# Altium schematic sheet LWIR_FPGA_Misc.SchDoc
size A4
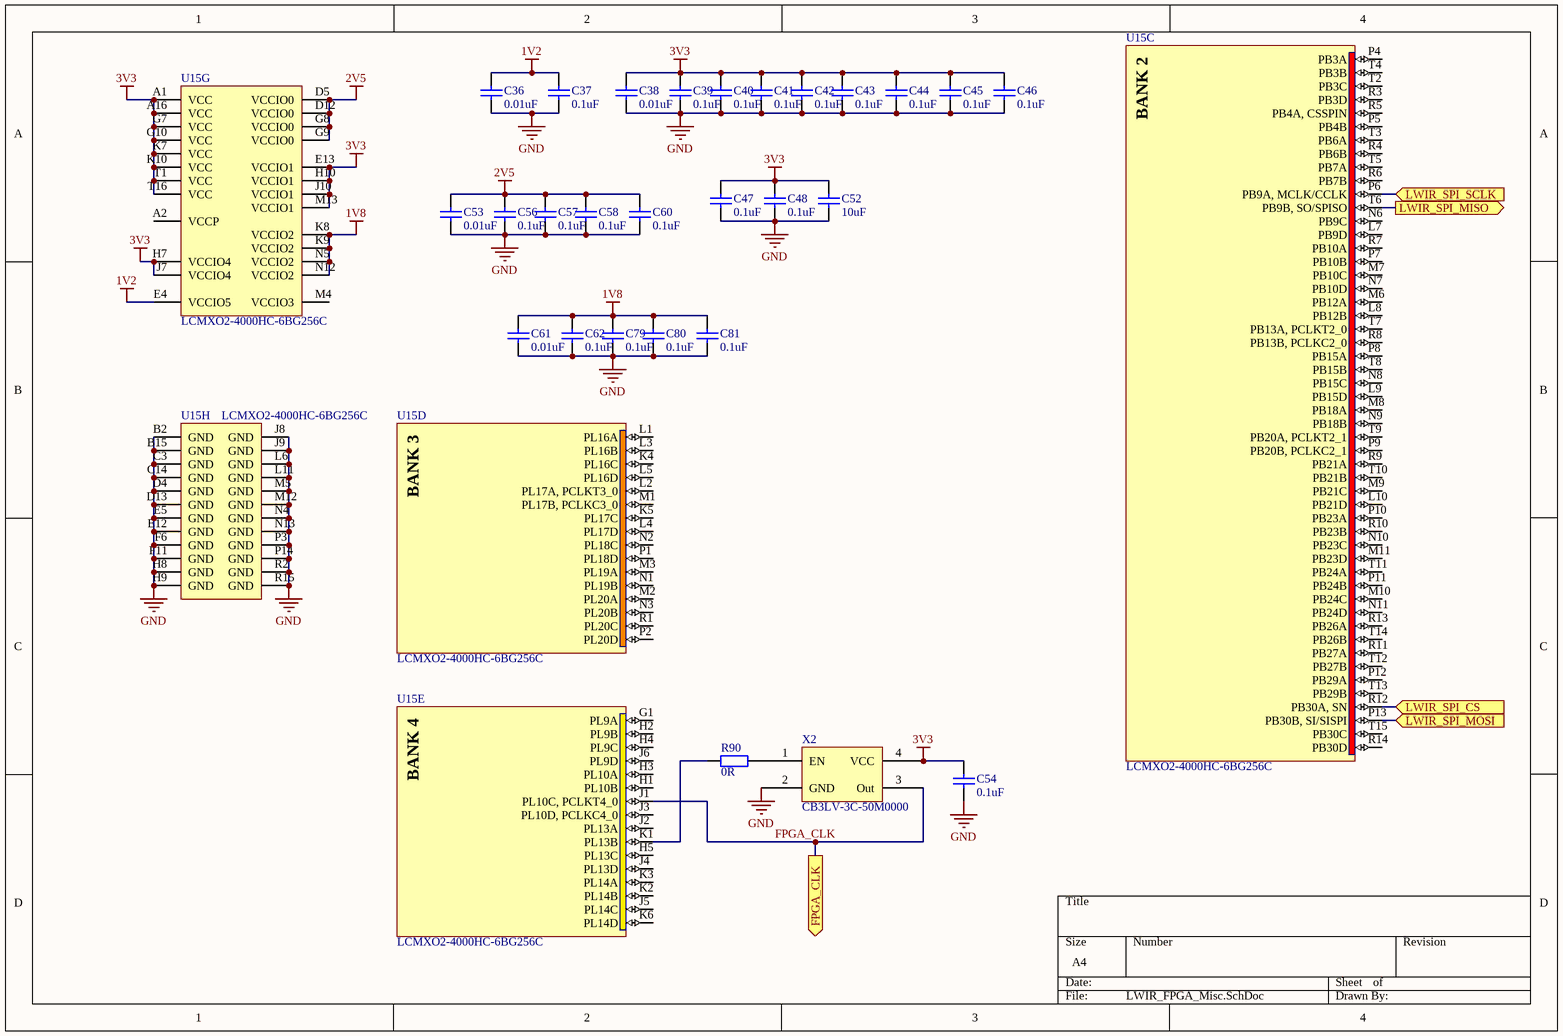
[diagram p0: LWIR_FPGA_Misc.SchDoc]

## Parts
C36  value 0.01uF  [0402C_M]  (hidden comment: GRM155R71H103KA88D)
C37  Capacitance: 0.1uF  [0402C_M]  (hidden comment: GRM155R71C104KA88D)
C38  value 0.01uF  [0402C_M]  (hidden comment: GRM155R71H103KA88D)
C39  Capacitance: 0.1uF  [0402C_M]  (hidden comment: GRM155R71C104KA88D)
C40  Capacitance: 0.1uF  [0402C_M]  (hidden comment: GRM155R71C104KA88D)
C41  Capacitance: 0.1uF  [0402C_M]  (hidden comment: GRM155R71C104KA88D)
C42  Capacitance: 0.1uF  [0402C_M]  (hidden comment: GRM155R71C104KA88D)
C43  Capacitance: 0.1uF  [0402C_M]  (hidden comment: GRM155R71C104KA88D)
C44  Capacitance: 0.1uF  [0402C_M]  (hidden comment: GRM155R71C104KA88D)
C45  Capacitance: 0.1uF  [0402C_M]  (hidden comment: GRM155R71C104KA88D)
C46  Capacitance: 0.1uF  [0402C_M]  (hidden comment: GRM155R71C104KA88D)
C47  Capacitance: 0.1uF  [0402C_M]  (hidden comment: GRM155R71C104KA88D)
C48  Capacitance: 0.1uF  [0402C_M]  (hidden comment: GRM155R71C104KA88D)
C52  value 10uF  [0603C_M]  (hidden comment: GRM188R60J106ME47D)
C53  value 0.01uF  [0402C_M]  (hidden comment: GRM155R71H103KA88D)
C54  Capacitance: 0.1uF  [0402C_M]  (hidden comment: GRM155R71C104KA88D)
C56  Capacitance: 0.1uF  [0402C_M]  (hidden comment: GRM155R71C104KA88D)
C57  Capacitance: 0.1uF  [0402C_M]  (hidden comment: GRM155R71C104KA88D)
C58  Capacitance: 0.1uF  [0402C_M]  (hidden comment: GRM155R71C104KA88D)
C60  Capacitance: 0.1uF  [0402C_M]  (hidden comment: GRM155R71C104KA88D)
C61  value 0.01uF  [0402C_M]  (hidden comment: GRM155R71H103KA88D)
C62  Capacitance: 0.1uF  [0402C_M]  (hidden comment: GRM155R71C104KA88D)
C79  Capacitance: 0.1uF  [0402C_M]  (hidden comment: GRM155R71C104KA88D)
C80  Capacitance: 0.1uF  [0402C_M]  (hidden comment: GRM155R71C104KA88D)
C81  Capacitance: 0.1uF  [0402C_M]  (hidden comment: GRM155R71C104KA88D)
R90  value 0R  [0402R_M]  (hidden comment: Generic resitor)
U15  LCMXO2-4000HC-6BG256C  [caBGA256]  (parts C,D,E,G,H of 8)
X2  CB3LV-3C-50M0000  [CB3LV-3C-50M0000]

## Ports
FPGA_CLK (out), LWIR_SPI_CS (in), LWIR_SPI_MISO (out), LWIR_SPI_MOSI (in), LWIR_SPI_SCLK (in)

## Nets
1V2: C36.2 C37.2 U15.E4(VCCIO5)
1V8: C61.2 C62.2 C79.2 C80.2 C81.2 U15.K8(VCCIO2) U15.K9(VCCIO2) U15.N5(VCCIO2) U15.N12(VCCIO2)
2V5: C53.2 C56.2 C57.2 C58.2 C60.2 U15.D5(VCCIO0) U15.D12(VCCIO0) U15.G8(VCCIO0) U15.G9(VCCIO0)
3V3: C38.2 C39.2 C40.2 C41.2 C42.2 C43.2 C44.2 C45.2 C46.2 C47.2 C48.2 C52.2 C54.2 U15.A1(VCC) U15.A16(VCC) U15.E13(VCCIO1) U15.G7(VCC) U15.G10(VCC) U15.H7(VCCIO4) U15.H10(VCCIO1) U15.J7(VCCIO4) U15.J10(VCCIO1) U15.K7(VCC) U15.K10(VCC) U15.M13(VCCIO1) U15.T1(VCC) U15.T16(VCC) X2.4(VCC)
GND: C36.1 C37.1 C38.1 C39.1 C40.1 C41.1 C42.1 C43.1 C44.1 C45.1 C46.1 C47.1 C48.1 C52.1 C53.1 C54.1 C56.1 C57.1 C58.1 C60.1 C61.1 C62.1 C79.1 C80.1 C81.1 U15.B2(GND) U15.B15(GND) U15.C3(GND) U15.C14(GND) U15.D4(GND) U15.D13(GND) U15.E5(GND) U15.E12(GND) U15.F6(GND) U15.F11(GND) U15.H8(GND) U15.H9(GND) U15.J8(GND) U15.J9(GND) U15.L6(GND) U15.L11(GND) U15.M5(GND) U15.M12(GND) U15.N4(GND) U15.N13(GND) U15.P3(GND) U15.P14(GND) U15.R2(GND) U15.R15(GND) X2.2(GND)
FPGA_CLK: U15.J1(PL10C,_PCLKT4_0) X2.3(Out) ; port FPGA_CLK
LWIR_SPI_CS: U15.R12(PB30A,_SN) ; port LWIR_SPI_CS
LWIR_SPI_MISO: U15.T6(PB9B,_SO/SPISO) ; port LWIR_SPI_MISO
LWIR_SPI_MOSI: U15.P13(PB30B,_SI/SISPI) ; port LWIR_SPI_MOSI
LWIR_SPI_SCLK: U15.P6(PB9A,_MCLK/CCLK) ; port LWIR_SPI_SCLK
NetR90_1: R90.1 U15.K1(PL13B)
NetR90_2: R90.2 X2.1(EN)

Not connected (* = marked no-connect by the designer): U15 A2(VCCP) G1(PL9A) H1(PL10B) H2(PL9B) H3(PL10A) H4(PL9C) H5(PL13C) J2(PL13A) J3(PL10D,_PCLKC4_0) J4(PL13D) J5(PL14C) J6(PL9D) K2(PL14B) K3(PL14A) K4(PL16C) K5(PL17C) K6(PL14D) L1(PL16A) L2(PL17A,_PCLKT3_0) L3(PL16B) L4(PL17D) L5(PL16D) L7(PB9D) L8(PB12B) L9(PB15D) L10(PB21D) M1(PL17B,_PCLKC3_0) M2(PL20A) M3(PL19A) M4(VCCIO3) M6(PB12A) M7(PB10C) M8(PB18A) M9(PB21C) M10(PB24C) M11(PB23D) N1(PL19B) N2(PL18C) N3(PL20B) N6(PB9C) N7(PB10D) N8(PB15C) N9(PB18B) N10(PB23C) N11(PB24D) P1(PL18D) P2(PL20D) P4(PB3A) P5(PB4B) P7(PB10B) P8(PB15A) P9(PB20B,_PCLKC2_1) P10(PB23A) P11(PB24B) P12(PB29A) R1(PL20C) R3(PB3D) R4(PB6B) R5(PB4A,_CSSPIN) R6(PB7B) R7(PB10A) R8(PB13B,_PCLKC2_0) R9(PB21A) R10(PB23B) R11(PB27A) R13(PB26A) R14(PB30D) T2(PB3C) T3(PB6A) T4(PB3B) T5(PB7A) T7(PB13A,_PCLKT2_0) T8(PB15B) T9(PB20A,_PCLKT2_1) T10(PB21B) T11(PB24A) T12(PB27B) T13(PB29B) T14(PB26B) T15(PB30C)

## Notes on the sheet
- (in symbol CMP-0111-00181-1, part C) BANK 2
- (in symbol CMP-0111-00181-1, part D) BANK 3
- (in symbol CMP-0111-00181-1, part E) BANK 4

## Library data of the parts
C36 C38 C53 C61 = GRM155R71H103KA88D: CAP CER 0.01uF 50V X7R 0402; Manufacturer: Murata Electronics North America; Tolerance: ±10%; Supplier 1: Digi-Key; Manufacturer Part Number: GRM155R71H103KA88D; RoHS: RoHS Compliant; Category: Capacitors; Stock 1: 10436079; Pricing 1: 1=0.1, 10=0.011, 100=0.005, 500=0.00354, 1000=0.00278, 2500=0.00253, 5000=0.00233 (USD); Packaging: Cut Tape (CT); Part Status: Active; Voltage - Rated: 50V; Temperature Coefficient: X7R; Operating Temperature: -55°C ~ 125°C; Features: -; Ratings: -; Applications: General Purpose; Mounting Type: Surface Mount, MLCC; Package / Case: 0402 (1005 Metric); Size / Dimension: 0.039" L x 0.020" W (1.00mm x 0.50mm); Height - Seated (Max): -; Thickness (Max): 0.022" (0.55mm); Lead Spacing: -; Lead Style: -; ComponentLink1URL: http://www.murata.com/~/media/webrenewal/support/library/catalog/products/capacitor/mlcc/c02e.pdf; ComponentLink1Description: http://www.murata.com/~/media/webrenewal/support/library/catalog/products/capacitor/mlcc/c02e.pdf; Supplier Part Number 1: 490-4516-1-ND
C37 C39-C48 C54 C56-C58 C60 C62 C79-C81 = GRM155R71C104KA88D: CAP CER 0.1UF 16V X7R 0402; Manufacturer: Murata Electronics North America; Tolerance: ±10%; Supplier 1: Digi-Key; Manufacturer Part Number: GRM155R71C104KA88D; RoHS: RoHS Compliant; Category: Capacitors; Stock 1: 58190082; Pricing 1: 1=0.1, 10=0.013, 100=0.0059, 500=0.00422, 1000=0.00332, 2500=0.00302, 5000=0.00278 (USD); Packaging: Cut Tape (CT); Part Status: Active; Voltage - Rated: 16V; Temperature Coefficient: X7R; Operating Temperature: -55°C ~ 125°C; Features: -; Ratings: -; Applications: General Purpose; Mounting Type: Surface Mount, MLCC; Package / Case: 0402 (1005 Metric); Size / Dimension: 0.039" L x 0.020" W (1.00mm x 0.50mm); Height - Seated (Max): -; Thickness (Max): 0.022" (0.55mm); Lead Spacing: -; Lead Style: -; ComponentLink1URL: http://www.murata.com/~/media/webrenewal/support/library/catalog/products/capacitor/mlcc/c02e.ashx; ComponentLink1Description: http://www.murata.com/~/media/webrenewal/support/library/catalog/products/capacitor/mlcc/c02e.ashx; Supplier Part Number 1: 490-3261-1-ND
C52 = GRM188R60J106ME47D: CAP CER 10UF 6.3V X5R 0603; Manufacturer: Murata Electronics North America; Tolerance: ±20%; Supplier 1: Digi-Key; Manufacturer Part Number: GRM188R60J106ME47D; RoHS: RoHS Compliant; Category: Capacitors; Stock 1: 13697850; Pricing 1: 1=0.17, 10=0.123, 100=0.0578, 500=0.04052, 1000=0.03355 (USD); Packaging: Cut Tape (CT); Part Status: Active; Voltage - Rated: 6.3V; Temperature Coefficient: X5R; Operating Temperature: -55°C ~ 85°C; Features: -; Ratings: -; Applications: General Purpose; Mounting Type: Surface Mount, MLCC; Package / Case: 0603 (1608 Metric); Size / Dimension: 0.063" L x 0.031" W (1.60mm x 0.80mm); Height - Seated (Max): -; Thickness (Max): 0.035" (0.90mm); Lead Spacing: -; Lead Style: -; ComponentLink1URL: http://www.murata.com/~/media/webrenewal/support/library/catalog/products/capacitor/mlcc/c02e.pdf; ComponentLink1Description: http://www.murata.com/~/media/webrenewal/support/library/catalog/products/capacitor/mlcc/c02e.pdf; Supplier Part Number 1: 490-3896-1-ND
R90 = Resistor
U15 = CMP-0111-00181-1: MachXO2 High Performance CPLD with 4320 LUTs, Voltage Regulator, 2.5V/3.3V, 256-pin caBGA, Speed Grade-6, Commercial Grade, Halogen Free (RoHS); PackageDescription: 256-Ball caBGA Package, 14 x 14 mm Body, 0.8 mm Pitch; DatasheetVersion: ver01.0, Nov-2010; PackageReference: caBGA256; PackageVersion: ver02.6, Nov-2010; Code_JEDEC: MO-275-JJAB-2; PartId: 1
X2 = CB3LV-3C-50M0000: OSC XO 50.000MHZ HCMOS TTL SMD; Manufacturer: CTS-Frequency Controls; Function: Enable/Disable; Output: HCMOS, TTL; Voltage - Supply: 3.3V; Frequency Stability: ±50ppm; Current - Supply (Max): 40mA; Current - Supply (Disable) (Max): 10µA; Supplier 1: Digi-Key; Manufacturer Part Number: CB3LV-3C-50M0000; RoHS: RoHS Compliant; Category: Crystals, Oscillators, Resonators; Stock 1: 20256; Pricing 1: 1=1.41, 10=1.35, 50=1.319, 100=1.1306, 500=1.09918 (USD); Packaging: Cut Tape (CT); Part Status: Active; Type: XO (Standard); Operating Temperature: -20°C ~ 70°C; Ratings: -; Mounting Type: Surface Mount; Package / Case: 4-SMD, No Lead; Size / Dimension: 0.276" L x 0.197" W (7.00mm x 5.00mm); Height - Seated (Max): 0.071" (1.80mm); ComponentLink1URL: http://www.ctscorp.com/wp-content/uploads/2015/11/008-0256-0.pdf; ComponentLink1Description: http://www.ctscorp.com/wp-content/uploads/2015/11/008-0256-0.pdf; Supplier Part Number 1: CTX283LVCT-ND